# EAGLE schematic Mergen Ground Station_V2.0 (EAGLE 9.6.2)

## Sheet 1 of 5
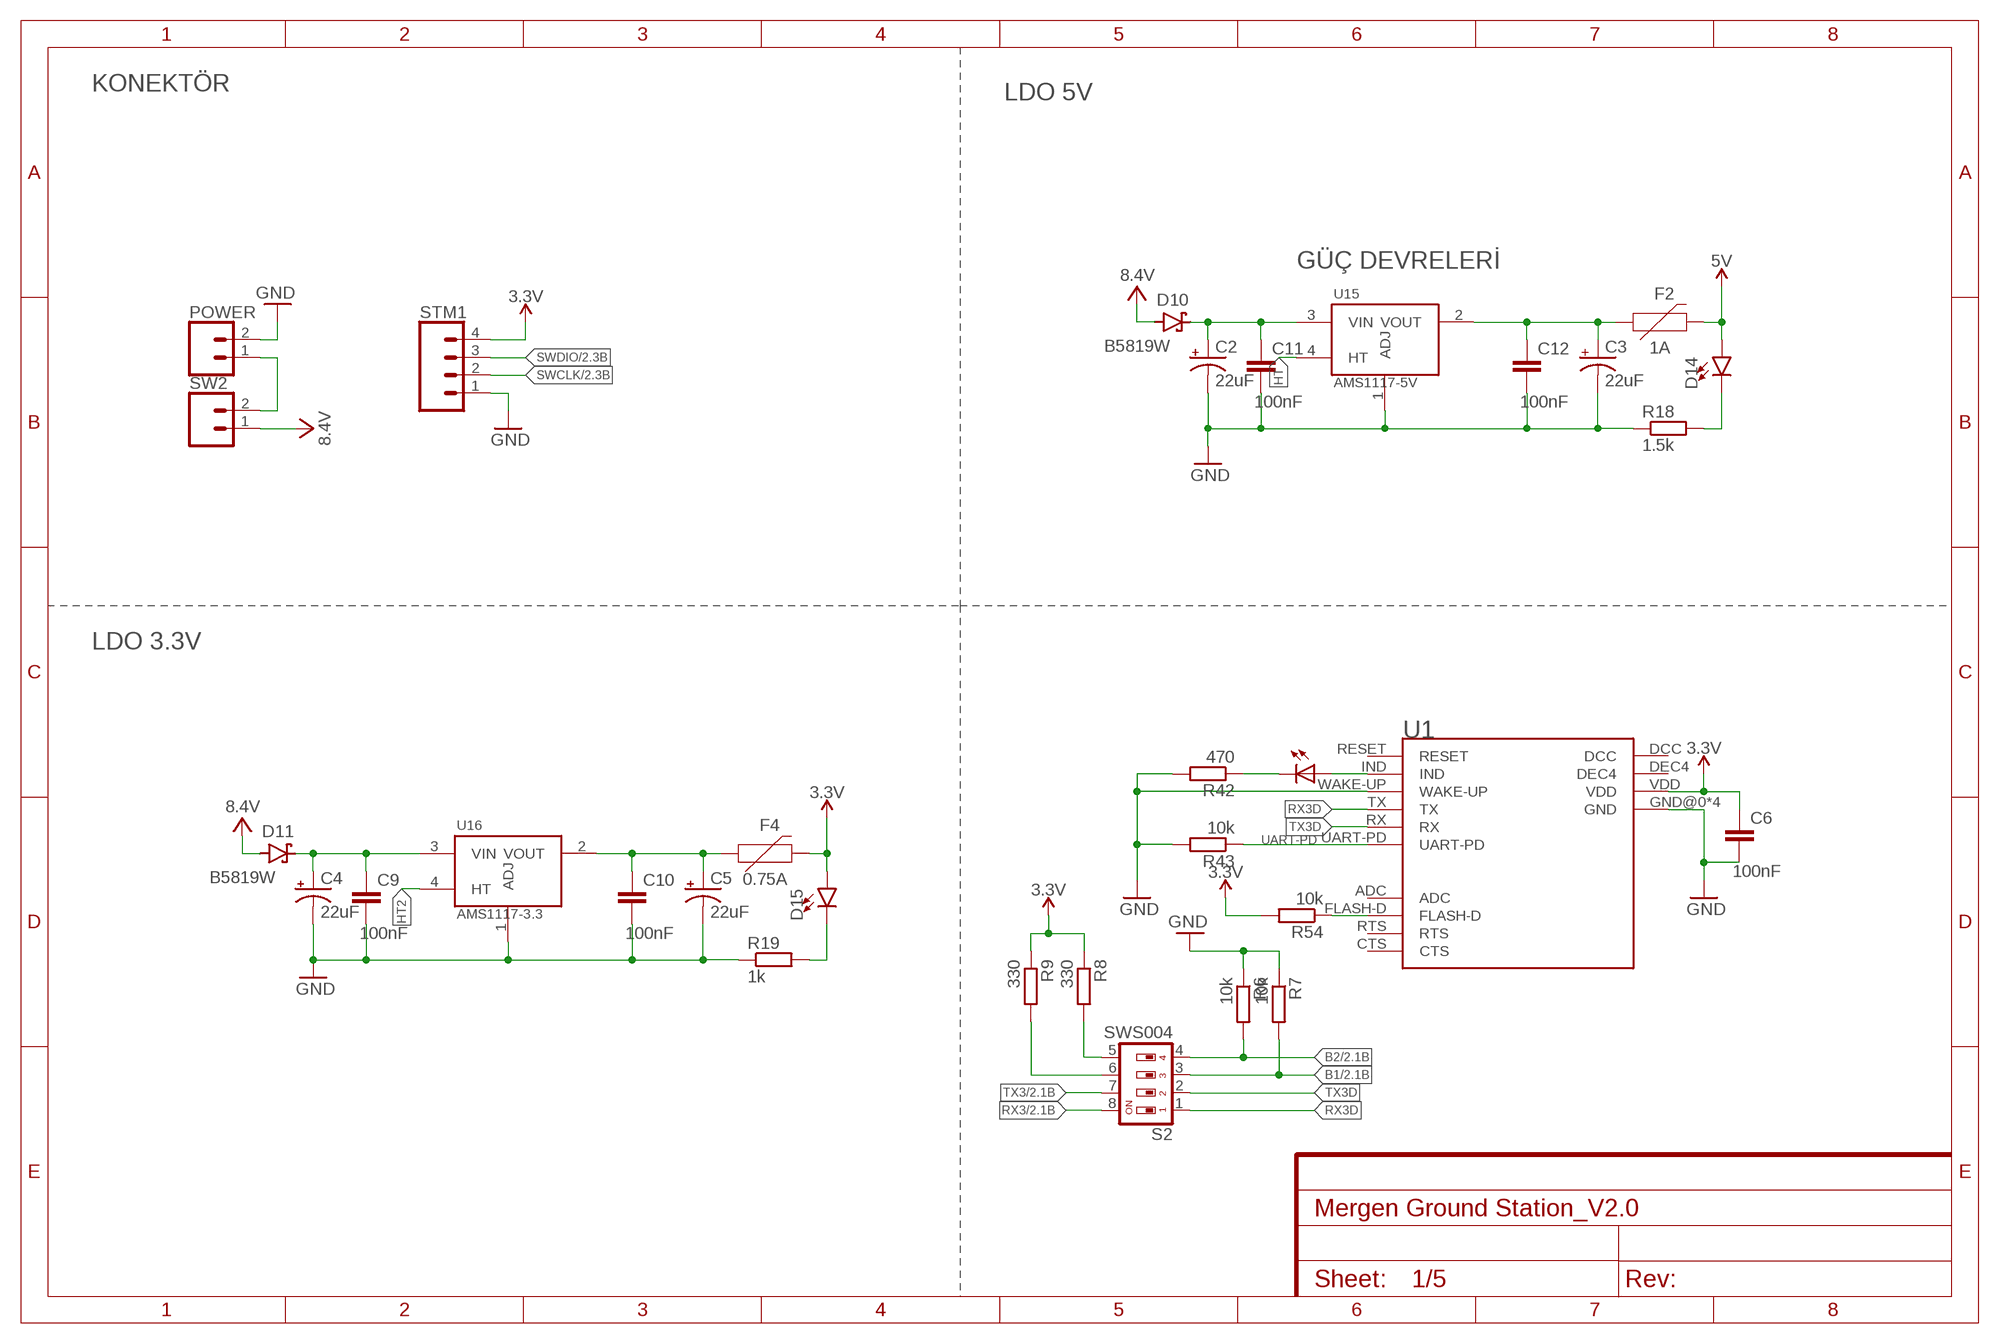
[diagram p0: schematic, sheet 1]

### Parts
C2  22uF  CPOL-USCT3528  [CT3528]
C3  22uF  CPOL-USCT3528  [CT3528]
C4  22uF  CPOL-USCT3528  [CT3528]
C5  22uF  CPOL-USCT3528  [CT3528]
C6  100nF  C-EUC0603  [C0603]
C9  100nF  C-EUC0603  [C0603]
C10  100nF  C-EUC0603  [C0603]
C11  100nF  C-EUC0603  [C0603]
C12  100nF  C-EUC0603  [C0603]
D10  B5819W  SCHOTTKY_MBR0520LT1GDO-219  [SODFL3718X115]
D11  B5819W  SCHOTTKY_MBR0520LT1GDO-219  [SODFL3718X115]
D14  LED0603  [LED-0603]
D15  LED0603  [LED-0603]
DRM3  kirmizi  LEDCHIP-LED0805  [CHIP-LED0805]
F2  1A  PPTC_HALF-AMP  [1206]
F4  0.75A  PPTC_HALF-AMP  [1206]
POWER  CONN_023.5MM-NO_SILK  [SCREWTERMINAL-3.5MM-2-NS]
R6  10k  R-EU_R0603  [R0603]
R7  10k  R-EU_R0603  [R0603]
R8  330  R-EU_R0603  [R0603]
R9  330  R-EU_R0603  [R0603]
R18  1.5k  R-EU_R0603  [R0603]
R19  1k  R-EU_R0603  [R0603]
R42  470  R-EU_R0603  [R0603]
R43  10k  R-EU_R0603  [R0603]
R54  10k  R-EU_R0603  [R0603]
S2  SWS004  [SMS-004]
STM1  CONN_04  [1X04]
SW2  CONN_023.5MM-NO_SILK  [SCREWTERMINAL-3.5MM-2-NS]
U1  MDBT42T-AT  [MDBT42T-AT]
U15  AMS1117-5V  AMS1117-3.3  [SOT229P700X180-4N]
U16  AMS1117-3.3  [SOT229P700X180-4N]

### Nets
3.3V: C6.1 D15.A F4.2 R8.1 R9.1 R54.2 STM1.4 U1.VDD ; also sheet 2,3,5
5V: D14.A F2.2 ; also sheet 4,5
B1: R7.2 S2.3 ; also sheet 2
B2: R6.2 S2.4 ; also sheet 2
FLASH-D: R54.1 U1.FLASH-D ; also sheet 2
GND: C2.- C3.- C4.- C5.- C6.2 C9.2 C10.2 C11.2 C12.2 POWER.2 R6.1 R7.1 R18.1 R19.1 R42.2 R43.2 STM1.1 U1.GND@0(GND) U1.GND@1(GND) U1.GND@2(GND) U1.GND@3(GND) U1.WAKE-UP U15.1(ADJ) U16.1(ADJ) ; also sheet 2,3,4,5
HT: U15.4(HT)
HT2: U16.4(HT)
N$5: DRM3.A U1.IND
N$6: DRM3.C R42.1
N$7: R9.2 S2.6
N$8: R8.2 S2.5
N$22: C2.+ C11.1 D10.1(C) U15.3(VIN)
N$23: C3.+ C12.1 F2.1 U15.2(VOUT)
N$24: C4.+ C9.1 D11.1(C) U16.3(VIN)
N$25: C5.+ C10.1 F4.1 U16.2(VOUT)
N$30: POWER.1 SW2.2
N$35: D14.C R18.2
N$36: D15.C R19.2
RX3: S2.8 ; also sheet 2,5
RX3D: S2.1 U1.TX
SWCLK: STM1.2 ; also sheet 2
SWDIO: STM1.3 ; also sheet 2
TX3: S2.7 ; also sheet 2,5
TX3D: S2.2 U1.RX
UART-PD: R43.1 U1.UART-PD ; also sheet 2
VCC: D10.2(A) D11.2(A) SW2.1 ; supply symbol labelled 8.4V ; also sheet 2,5
Unconnected: U1.ADC U1.CTS U1.DCC U1.DEC4 U1.RESET U1.RTS

### Notes on the sheet
- KONEKTÖR
- LDO 5V
- GÜÇ DEVRELERİ
- LDO 3.3V

## Sheet 2 of 5
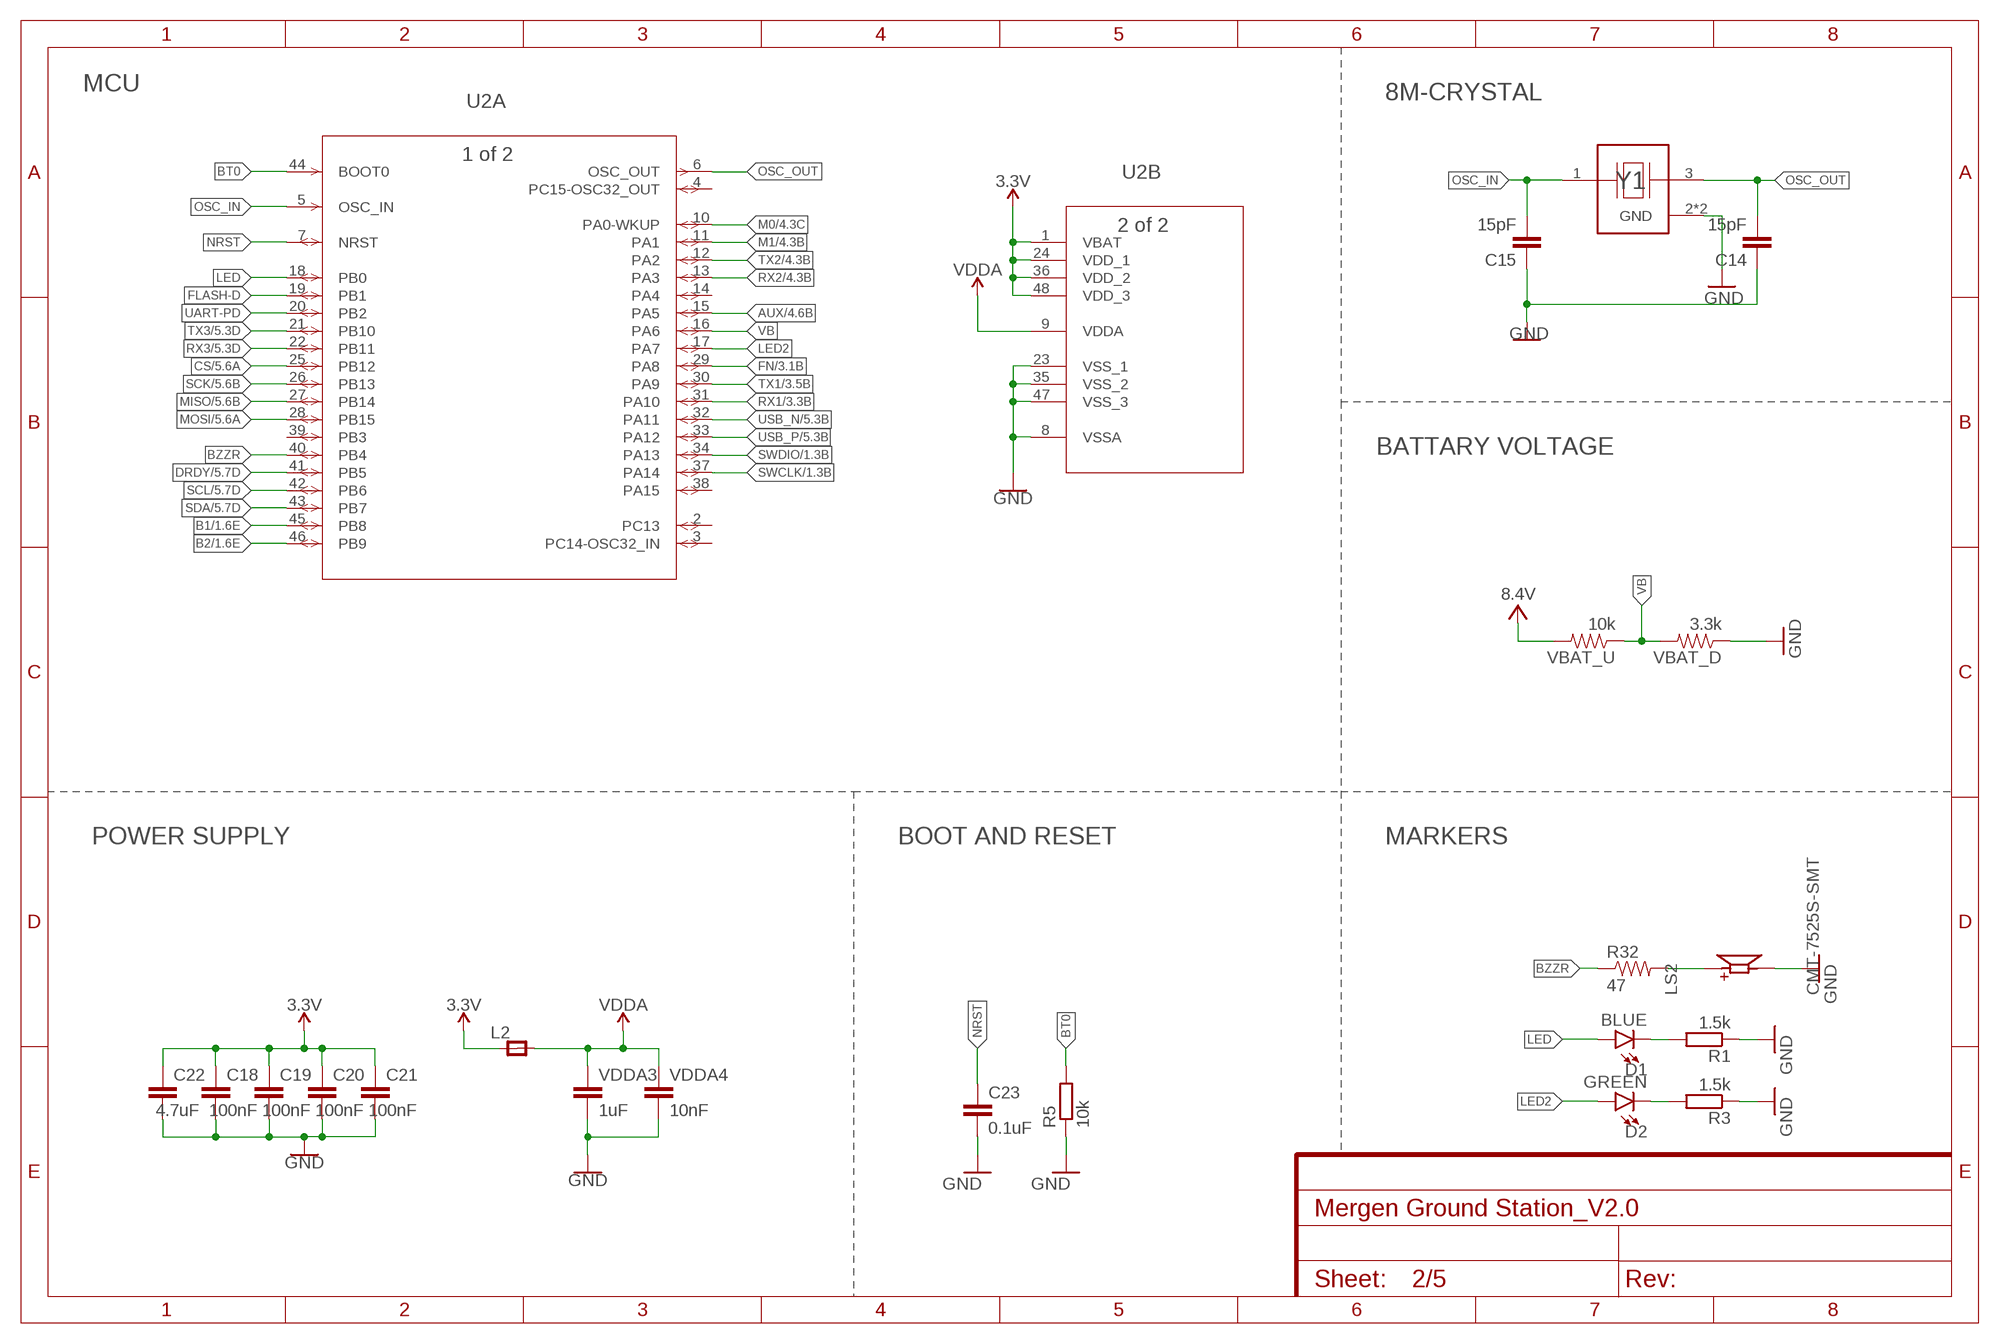
[diagram p1: schematic, sheet 2]

### Parts
C14  15pF  C-EUC0603  [C0603]
C15  15pF  C-EUC0603  [C0603]
C18  100nF  C-EUC0603  [C0603]
C19  100nF  C-EUC0603  [C0603]
C20  100nF  C-EUC0603  [C0603]
C21  100nF  C-EUC0603  [C0603]
C22  4.7uF  C-EUC0603  [C0603]
C23  0.1uF  C-EUC0603  [C0603]
D1  BLUE  LED0603  [LED-0603]
D2  GREEN  LED0603  [LED-0603]
L2  RC-MASTER-SMD_FB_0805MP  [RC-MASTER-SMD_L0805MP]
LS2  CMT-7525S-SMT  [CUI_CMT-7525S-SMT]
R1  1.5k  R-EU_R0603  [R0603]
R3  1.5k  R-EU_R0603  [R0603]
R5  10k  R-EU_R0603  [R0603]
R32  47  0OHM-0603-1/10W-5%  [0603]
U2  STM32F103C8T6  [LQFP48-7X7MM]
VBAT_D  3.3k  2.0KOHM1/10W5%(0603)  [0603-RES]
VBAT_U  10k  2.0KOHM1/10W5%(0603)  [0603-RES]
VDDA3  1uF  0.1UF-0603-25V-(+80/-20%)  [0603]
VDDA4  10nF  0.1UF-0603-25V-(+80/-20%)  [0603]
Y1  ABMM2-8.000MHZ-E2-T  [XTAL_ABMM2-8.000MHZ-E2-T]

### Nets
3.3V: C18.1 C19.1 C20.1 C21.1 C22.1 L2.1 U2.1(B:VBAT) U2.24(B:VDD_1) U2.36(B:VDD_2) U2.48(B:VDD_3) ; also sheet 1,3,5
AUX: U2.15(A:PA5) ; also sheet 4
B1: U2.45(A:PB8) ; also sheet 1
B2: U2.46(A:PB9) ; also sheet 1
BT0: R5.2 U2.44(A:BOOT0)
BZZR: R32.1 U2.40(A:PB4)
CS: U2.25(A:PB12) ; also sheet 5
DRDY: U2.41(A:PB5) ; also sheet 5
FLASH-D: U2.19(A:PB1) ; also sheet 1
FN: U2.29(A:PA8) ; also sheet 3
GND: C14.1 C15.1 C18.2 C19.2 C20.2 C21.2 C22.2 C23.2 LS2.N R1.1 R3.1 R5.1 U2.8(B:VSSA) U2.23(B:VSS_1) U2.35(B:VSS_2) U2.47(B:VSS_3) VBAT_D.1 VDDA3.2 VDDA4.2 Y1.2(GND) Y1.4(GND) ; also sheet 1,3,4,5
LED: D1.A U2.18(A:PB0)
LED2: D2.A U2.17(A:PA7)
M0: U2.10(A:PA0-WKUP) ; also sheet 4
M1: U2.11(A:PA1) ; also sheet 4
MISO: U2.27(A:PB14) ; also sheet 5
MOSI: U2.28(A:PB15) ; also sheet 5
N$1: D1.C R1.2
N$3: D2.C R3.2
N$4: LS2.P R32.2
NRST: C23.1 U2.7(A:NRST)
OSC_IN: C15.2 U2.5(A:OSC_IN) Y1.1
OSC_OUT: C14.2 U2.6(A:OSC_OUT) Y1.3
RX1: U2.31(A:PA10) ; also sheet 3
RX2: U2.13(A:PA3) ; also sheet 4
RX3: U2.22(A:PB11) ; also sheet 1,5
SCK: U2.26(A:PB13) ; also sheet 5
SCL: U2.42(A:PB6) ; also sheet 5
SDA: U2.43(A:PB7) ; also sheet 5
SWCLK: U2.37(A:PA14) ; also sheet 1
SWDIO: U2.34(A:PA13) ; also sheet 1
TX1: U2.30(A:PA9) ; also sheet 3
TX2: U2.12(A:PA2) ; also sheet 4
TX3: U2.21(A:PB10) ; also sheet 1,5
UART-PD: U2.20(A:PB2) ; also sheet 1
USB_N: U2.32(A:PA11) ; also sheet 5
USB_P: U2.33(A:PA12) ; also sheet 5
VB: U2.16(A:PA6) VBAT_D.2 VBAT_U.1
VCC: VBAT_U.2 ; supply symbol labelled 8.4V ; also sheet 1,5
VDDA: L2.2 U2.9(B:VDDA) VDDA3.1 VDDA4.1
Unconnected: U2.2(A:PC13) U2.3(A:PC14-OSC32_IN) U2.4(A:PC15-OSC32_OUT) U2.14(A:PA4) U2.38(A:PA15) U2.39(A:PB3)

### Notes on the sheet
- MCU
- 8M-CRYSTAL
- BATTARY VOLTAGE
- POWER SUPPLY | BOOT AND RESET | MARKERS

## Sheet 3 of 5
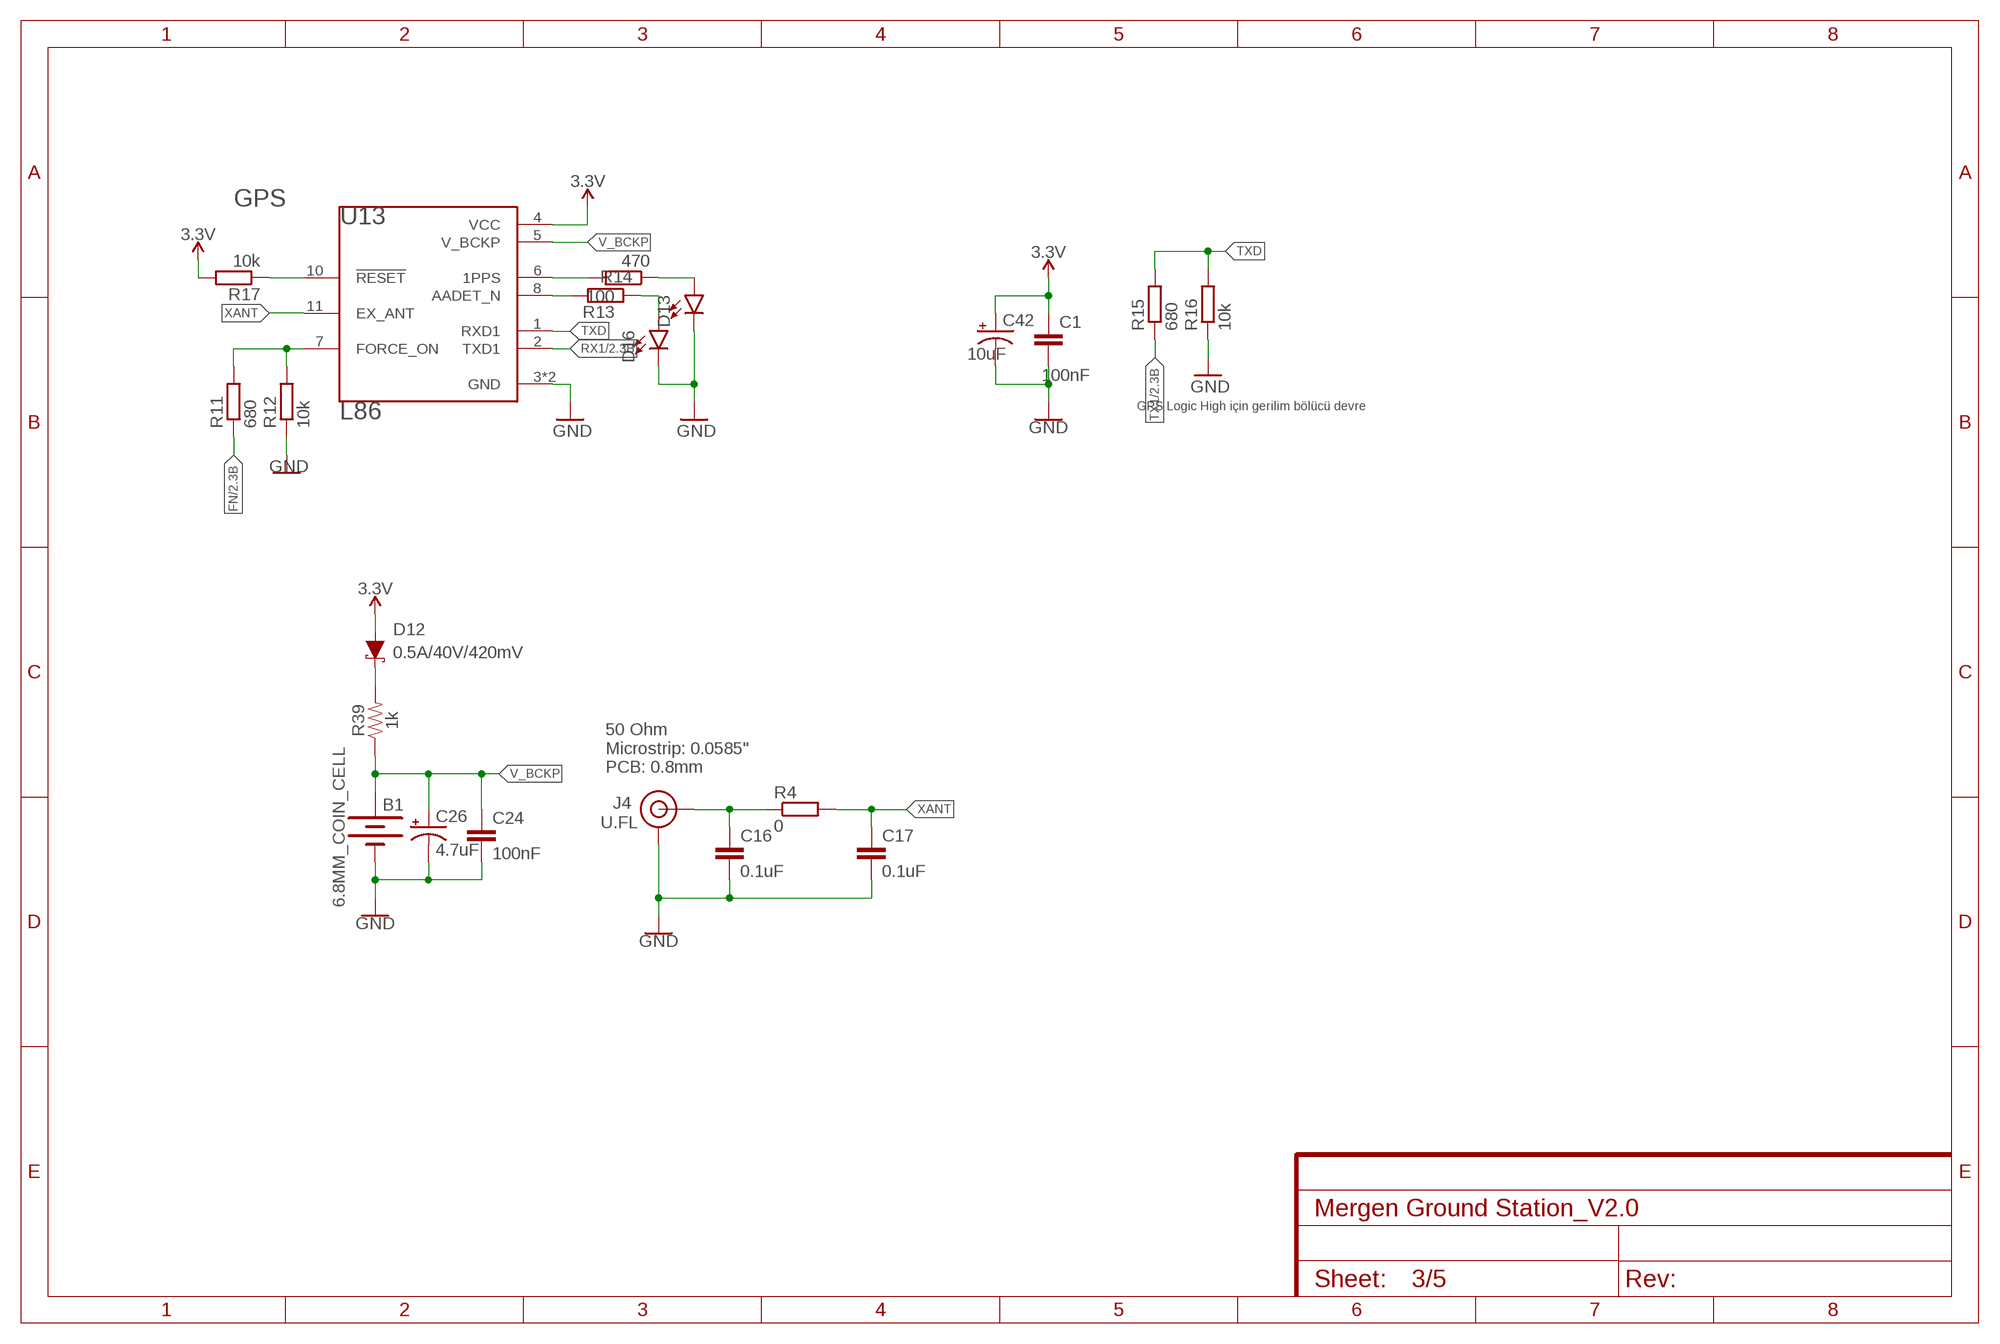
[diagram p2: schematic, sheet 3]

### Parts
B1  6.8MM_COIN_CELL  BATTERY-6.8MM_SMD  [BATTCON-6.8MM]
C1  100nF  C-EUC0603  [C0603]
C16  0.1uF  C-EUC0603  [C0603]
C17  0.1uF  C-EUC0603  [C0603]
C24  100nF  C-EUC0603  [C0603]
C26  4.7uF  CPOL-USA/3216-18R  [A/3216-18R]
C42  10uF  10UF-POLAR-EIA3216-16V-10%(TANT)  [EIA3216]
D12  0.5A/40V/420mV  DIODE-SCHOTTKY-PMEG4005EJ  [SOD-323]
D13  LED0603  [LED-0603]
D16  LED0603  [LED-0603]
J4  U.FL  U.FL2PIN  [U.FL]
R4  0  R-EU_R0603  [R0603]
R11  680  R-EU_R0603  [R0603]
R12  10k  R-EU_R0603  [R0603]
R13  100  R-EU_R0603  [R0603]
R14  470  R-EU_R0603  [R0603]
R15  680  R-EU_R0603  [R0603]
R16  10k  R-EU_R0603  [R0603]
R17  10k  R-EU_R0603  [R0603]
R39  1k  1KOHM-0603-1/10W-1%  [0603]
U13  L86  [XCVR_L86]

### Nets
3.3V: C1.1 C42.+ D12.A R17.2 U13.4(VCC) ; also sheet 1,2,5
FN: R11.1 ; also sheet 2
GND: B1.- C1.2 C16.2 C17.2 C24.2 C26.- C42.- D13.C D16.C J4.1(GND) J4.2(GND) R12.1 R16.1 U13.3(GND) U13.12(GND) ; also sheet 1,2,4,5
N$2: D16.A R13.1
N$31: D12.C R39.2
N$32: R17.1 U13.10(!RESET)
N$33: R14.2 U13.6(1PPS)
N$34: D13.A R14.1
N$37: R13.2 U13.8(AADET_N)
N$39: C16.1 J4.FEED(SIGNAL) R4.1
N$40: R11.2 R12.2 U13.7(FORCE_ON)
RX1: U13.2(TXD1) ; also sheet 2
TX1: R15.1 ; also sheet 2
TXD: R15.2 R16.2 U13.1(RXD1)
V_BCKP: B1.+ C24.1 C26.+ R39.1 U13.5(V_BCKP)
XANT: C17.1 R4.2 U13.11(EX_ANT)

### Notes on the sheet
- GPS
- GPS Logic High için gerilim bölücü devre
- 50 Ohm 
  Microstrip: 0.0585"
  PCB: 0.8mm

## Sheet 4 of 5
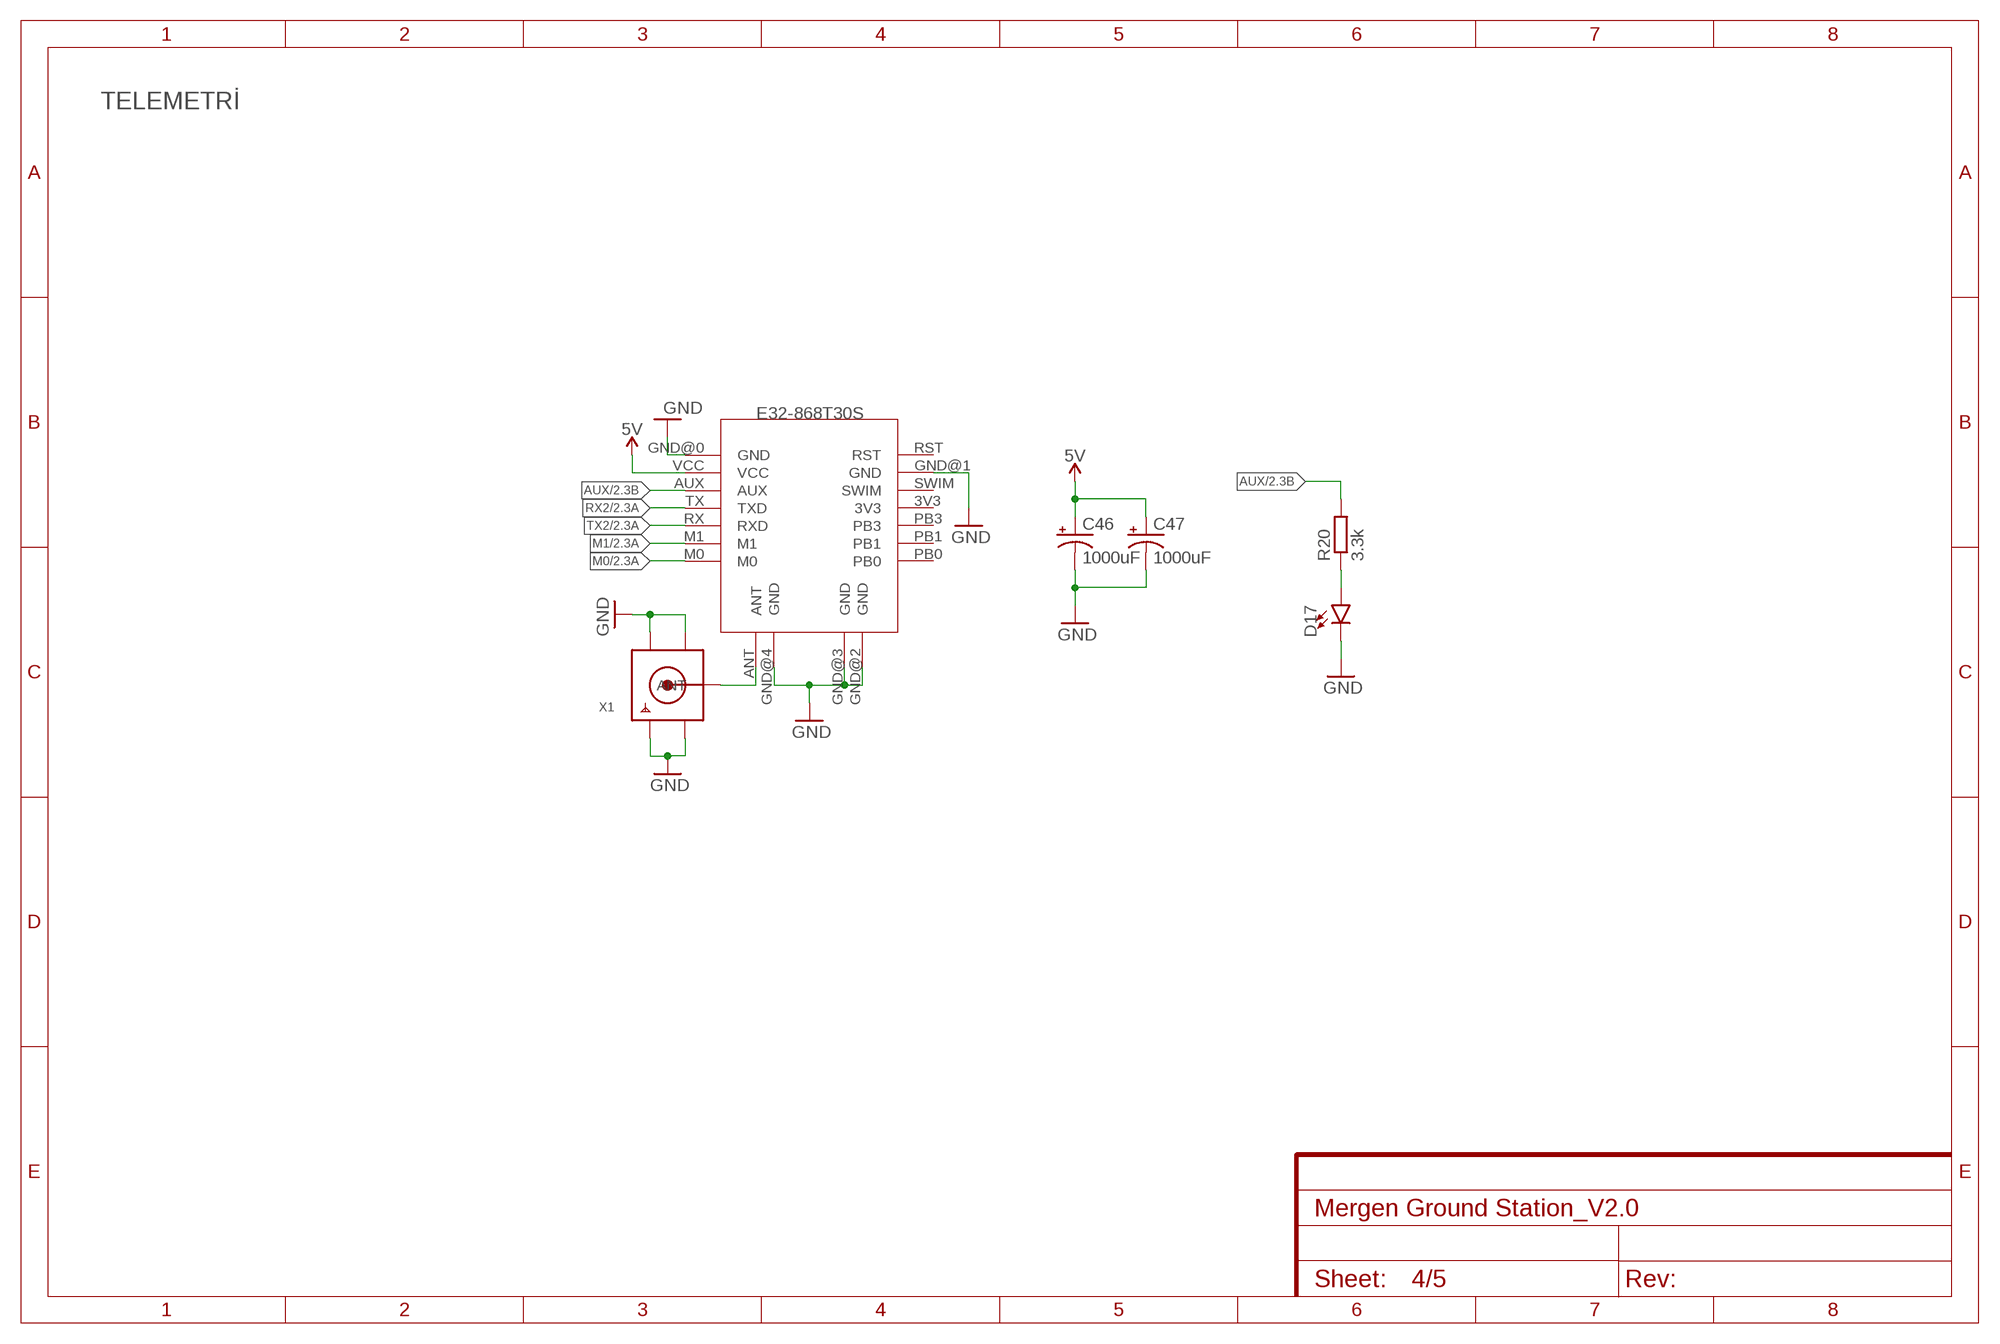
[diagram p3: schematic, sheet 4]

### Parts
C46  1000uF  CPOL-US150CLZ-1010  [150CLZ-1010]
C47  1000uF  CPOL-US150CLZ-1010  [150CLZ-1010]
D17  LED0603  [LED-0603]
R20  3.3k  R-EU_R0603  [R0603]
U14  E32-868T30S  [E32-868T30S]
X1  SMACONNECTOR  [SMA90_DIP]

### Nets
5V: C46.+ C47.+ U14.VCC ; also sheet 1,5
AUX: R20.2 U14.AUX ; also sheet 2
GND: C46.- C47.- D17.C U14.GND@0(GND) U14.GND@1(GND) U14.GND@2(GND) U14.GND@3(GND) U14.GND@4(GND) X1.GND1 X1.GND2 X1.GND3 X1.GND4 ; also sheet 1,2,3,5
M0: U14.M0 ; also sheet 2
M1: U14.M1 ; also sheet 2
N$27: U14.ANT X1.ANTENNA(ANT)
N$41: D17.A R20.1
RX2: U14.TX(TXD) ; also sheet 2
TX2: U14.RX(RXD) ; also sheet 2
Unconnected: U14.3V3 U14.PB0 U14.PB1 U14.PB3 U14.RST U14.SWIM

### Notes on the sheet
- TELEMETRİ

## Sheet 5 of 5
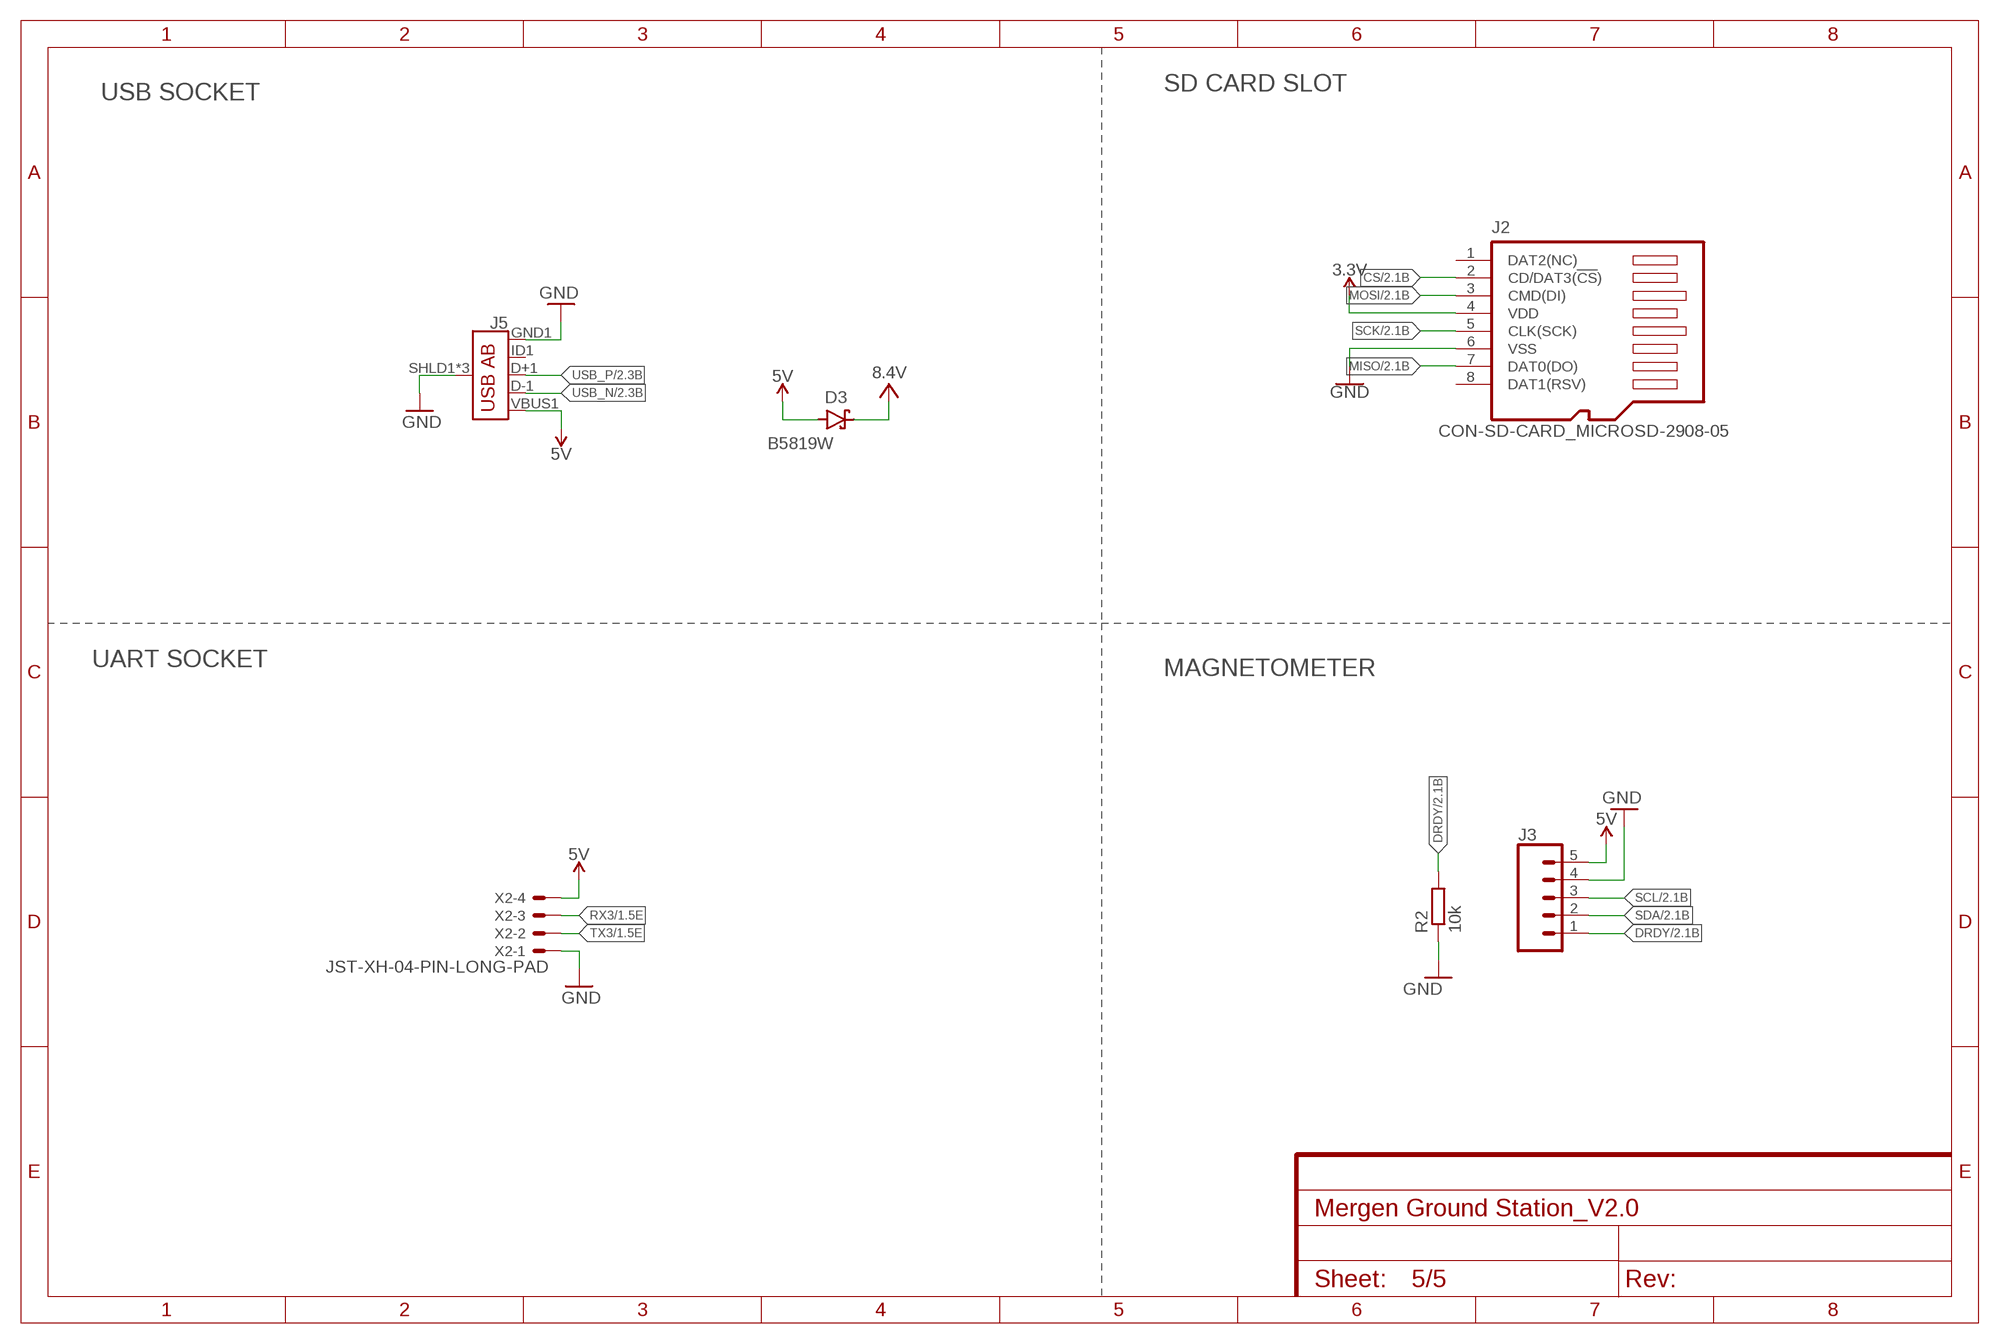
[diagram p4: schematic, sheet 5]

### Parts
D3  B5819W  SCHOTTKY_MBR0520LT1GDO-219  [SODFL3718X115]
J2  CON-SD-CARD_MICROSD-2908-05  [CON-SD-CARD_2908-05]
J3  CONN_05LOCK_LONGPADS  [1X05_LOCK_LONGPADS]
J5  USB_AB_SMT  [USB-AB-MICRO-SMD]
R2  10k  R-EU_R0603  [R0603]
X2  JST-XH-04-PIN-LONG-PAD  [JST-XH-04-PACKAGE-LONG-PAD]

### Nets
3.3V: J2.4(VDD) ; also sheet 1,2,3
5V: D3.2(A) J3.5 J5.VBUS1(VBUS) X2.4 ; also sheet 1,4
CS: J2.2(CD/DAT3(!CS!)) ; also sheet 2
DRDY: J3.1 R2.2 ; also sheet 2
GND: J2.6(VSS) J3.4 J5.GND1(GND) J5.SHLD1(SHIELD) J5.SHLD2(SHIELD) J5.SHLD3(SHIELD) R2.1 X2.1 ; also sheet 1,2,3,4
MISO: J2.7(DAT0(DO)) ; also sheet 2
MOSI: J2.3(CMD(DI)) ; also sheet 2
RX3: X2.3 ; also sheet 1,2
SCK: J2.5(CLK(SCK)) ; also sheet 2
SCL: J3.3 ; also sheet 2
SDA: J3.2 ; also sheet 2
TX3: X2.2 ; also sheet 1,2
USB_N: J5.D-1(D-) ; also sheet 2
USB_P: J5.D+1(D+) ; also sheet 2
VCC: D3.1(C) ; supply symbol labelled 8.4V ; also sheet 1,2
Unconnected: J2.1(DAT2(NC)) J2.8(DAT1(RSV)) J2.GND@1(GND) J2.GND@2(GND) J2.GND@3(GND) J2.GND@4(GND) J5.ID1(USBID)

### Notes on the sheet
- SD CARD SLOT
- USB SOCKET
- UART SOCKET
- MAGNETOMETER

## Library data of the parts
B1 = SparkFun-Batteries:BATTERY: Battery - Single Cell A variety of battery chemistries, sizes, and footprints. Device List: 20MM_PTH - Coin Cell Battery Holder - 20mm (PTH) <https://www.sparkfun.com/products/783> 6.8MM_PTH - Coin Cell Battery Holder - 6.8MM(SMD) <https://www.digikey.com/product-detail/en/seiko-instruments/MS621FE-FL11E/728-1057-ND/1889208?WT.srch=1&gclid=CNOQ5a6LzdQCFZS2wAodXCkE0g> 12MM_SMD - Coin Cell Battery Holder - 12mm (SMD) <https://www.sparkfun.com/products/10592> 12MM_PTH - Coin Cell Battery Holder - 12mm (PTH) <https://www.sparkfun.com/products/7948> 20MM_SMD - 20mm Coin Cell Battery Holder (SMD) (2 legs) Used on the Big Time Watch Kit <https://www.sparkfun.com/products/11734> 20MM_SMD_4LEGS - Coin Cell Battery Holder - 20mm (SMD) <https://www.sparkfun.com/products/11892> 20MM_SMD_4LEGS_OVERPASTE - Coin Cell Battery Holder - 20mm (SMD) <https://www.sparkfun.com/products/11892> (Over-paste on the legs) 24.5MM_PTH - Coin Cell Battery Holder - 24.5mm (PTH) <https://www.sparkfun.com/products/8863> 9V - 9V Battery Holder - PC Mount Used on the SparkFun SparkPunk Sound Kit <https://www.sparkfun.com/products/11177> and SparkFun SparkPunk Sequencer Kit <https://www.sparkfun.com/products/12707> 18650 - Battery Holder - 18650 (PTH) <https://www.sparkfun.com/products/13113> AA - Battery Holder - 1xAA (PTH) <https://www.sparkfun.com/products/7949> AAA - Battery Holder - 1xAAA (PTH) <https://www.sparkfun.com/products/12718> AA_KIT - Battery Holder - 1xAA (PTH) <https://www.sparkfun.com/products/7949> Special kit package - pads only have exposed copper on one side of the board. AAA_KIT - Battery Holder - 1xAAA (PTH) <https://www.sparkfun.com/products/12718> Special kit package - pads only have exposed copper on one side of the board.; PROD_ID: BATT-13734
C1 C6 C9-C12 C14-C24 = rcl:C-EU: CAPACITOR, European symbol; SPICEPREFIX: C
C2-C5 C26 = rcl:CPOL-US: POLARIZED CAPACITOR, American symbol; SPICEPREFIX: C
C42 = SparkFun-Capacitors:10UF-POLAR: 10.0µF polarized capacitors A capacitor is a passive two-terminal electrical component used to store electrical energy temporarily in an electric field.; PROD_ID: CAP-00811
C46 C47 = adafruit:CPOL-US: POLARIZED CAPACITOR, American symbol
D1 D2 D13-D17 = SparkFun-LED:LED: LED (Generic) Standard schematic elements and footprints for 5mm, 3mm, 1206, and 0603 sized LEDs. Generic LEDs with no color specified.
D3 D10 D11 = Diode:SCHOTTKY_: Schottky Diode - Popular parts; CATEGORY: Diode; DESCRIPTION: DIODE SCHOTTKY 20V 500MA SOD123; MANUFACTURER: ON Semiconductor; MPN: MBR0520LT1G; SUB-CATEGORY: Schottky; VALUE: MBR0520LT1G
D12 = SparkFun-DiscreteSemi:DIODE-SCHOTTKY: Schottky diode A Schottky diode is a semiconductor diode which has a low forward voltage drop and a very fast switching action.; PROD_ID: DIO-10955
DRM3 = led:LED: LED OSRAM: - CHIPLED LG R971, LG N971, LY N971, LG Q971, LY Q971, LO R971, LY R971 LH N974, LH R974 LS Q976, LO Q976, LY Q976 LO Q996 - Hyper CHIPLED LW Q18S LB Q993, LB Q99A, LB R99A - SideLED LS A670, LO A670, LY A670, LG A670, LP A670 LB A673, LV A673, LT A673, LW A673 LH A674 LY A675 LS A676, LA A676, LO A676, LY A676, LW A676 LS A679, LY A679, LG A679 - Hyper Micro SIDELED® LS Y876, LA Y876, LO Y876, LY Y876 LT Y87S - SmartLED LW L88C, LW L88S LB L89C, LB L89S, LG L890 LS L89K, LO L89K, LY L89K LS L896, LA L896, LO L896, LY L896 - TOPLED LS T670, LO T670, LY T670, LG T670, LP T670 LSG T670, LSP T670, LSY T670, LOP T670, LYG T670 LG T671, LOG T671, LSG T671 LB T673, LV T673, LT T673, LW T673 LH T674 LS T676, LA T676, LO T676, LY T676, LB T676, LH T676, LSB T676, LW T676 LB T67C, LV T67C, LT T67C, LS T67K, LO T67K, LY T67K, LW E67C LS E67B, LA E67B, LO E67B, LY E67B, LB E67C, LV E67C, LT E67C LW T67C LS T679, LY T679, LG T679 LS T770, LO T770, LY T770, LG T770, LP T770 LB T773, LV T773, LT T773, LW T773 LH T774 LS E675, LA E675, LY E675, LS T675 LS T776, LA T776, LO T776, LY T776, LB T776 LHGB T686 LT T68C, LB T68C - Hyper Mini TOPLED® LB M676 - Mini TOPLED Santana® LG M470 LS M47K, LO M47K, LY M47K Source: http://www.osram.convergy.de LUXEON: - LUMILED® LXK2-PW12-R00, LXK2-PW12-S00, LXK2-PW14-U00, LXK2-PW14-V00 LXK2-PM12-R00, LXK2-PM12-S00, LXK2-PM14-U00 LXK2-PE12-Q00, LXK2-PE12-R00, LXK2-PE12-S00, LXK2-PE14-T00, LXK2-PE14-U00 LXK2-PB12-K00, LXK2-PB12-L00, LXK2-PB12-M00, LXK2-PB14-N00, LXK2-PB14-P00, LXK2-PB14-Q00 LXK2-PR12-L00, LXK2-PR12-M00, LXK2-PR14-Q00, LXK2-PR14-R00 LXK2-PD12-Q00, LXK2-PD12-R00, LXK2-PD12-S00 LXK2-PH12-R00, LXK2-PH12-S00 LXK2-PL12-P00, LXK2-PL12-Q00, LXK2-PL12-R00 Source: www.luxeon.com KINGBRIGHT: KA-3528ASYC Source: www.kingbright.com
F2 F4 = SparkFun-Fuses:PPTC: Resettable Fuse PPTC Resettable Fuse. Really a sort of resistor with a polymeric positive temperature coefficient whose resistance increases dramatically with an increase in temperature. When heated by the power passing through the resistance rises causing the current to be limited, protecting the circuit. This is achieved by the transition of the polymer from a crystalline to an amorphous state where the conductive carbon separates breaking the conductive pathways found in the cool crystalline structure. When a PPTC cools back down it resumes conducting letting the circuit turn back on. SparkFun Products: SparkFun RedBoard - Programmed with Arduino <https://www.sparkfun.com/products/12757> Pro Micro - 5V/16MHz <https://www.sparkfun.com/products/12640> Arduino Pro 328 - 5V/16MHz <https://www.sparkfun.com/products/10915> MP3 Trigger <https://www.sparkfun.com/products/13720>; PROD_ID: RES-08585; VALUE: 6V/0.5A
J2 = 52101-101-REV-A_v16:CON-SD-CARD_MICROSD-: microSD Connector
J3 = SparkFun-Connectors:CONN_05: Multi connection point. Often used as Generic Header-pin footprint for 0.1 inch spaced/style header connections On any of the 0.1 inch spaced packages, you can populate with these: Break Away Headers - Straight <https://www.sparkfun.com/products/116> (PRT-00116) Break Away Male Headers - Right Angle <https://www.sparkfun.com/products/553> (PRT-00553) Female Headers <https://www.sparkfun.com/products/115> (PRT-00115) Break Away Headers - Machine Pin <https://www.sparkfun.com/products/117> (PRT-00117) Break Away Female Headers - Swiss Machine Pin <https://www.sparkfun.com/products/743> (PRT-00743) For SCREWTERMINALS and SPRING TERMINALS visit here: Screw Terimnals on SparkFun.com <https://www.sparkfun.com/search/results?term=Screw+Terminals> (5mm/3.5mm/2.54mm spacing) This device is also useful as a general connection point to wire up your design to another part of your project. Our various solder wires solder well into these plated through hole pads. Hook-Up Wire - Assortment (Stranded, 22 AWG) <https://www.sparkfun.com/products/11375> (PRT-11375) Hook-Up Wire - Assortment (Solid Core, 22 AWG) <https://www.sparkfun.com/products/11367> (PRT-11367) View the entire wire category on our website here <https://www.sparkfun.com/categories/141> Special notes: Molex polarized connector foot print use with SKU : PRT-08231 with associated crimp pins and housings. 1MM SMD Version SKU: PRT-10208
J4 = SparkFun-Connectors:U.FL2PIN: SMD Antenna Connector - U.FL 2mm height, 3.0mm x 3.0mm receptacle size. SparkFun Products: SparkFun WiFi Shield - ESP8266 <https://www.sparkfun.com/products/13287> SparkFun ESP8266 Thing <https://www.sparkfun.com/products/13231> SparkFun MiniGen - Pro Mini Signal Generator Shield <https://www.sparkfun.com/products/11420>; PROD_ID: CONN-09193; SF_ID: WRL-09144
J5 = SparkFun-Connectors:USB_AB: USB Type AB Micro Connector OTG-compatible. 5 pins, 3 shield pins SparkFun Products: IOIO-OTG <https://www.sparkfun.com/products/13613> SparkFun SAMD21 Mini Breakout <https://www.sparkfun.com/products/13664>; PROD_ID: CONN-11794
L2 = 52101-101-REV-A_v16:RC-MASTER-SMD_FB_: FERRITE BEAD
LS2 = CMT-7525S-SMT:CMT-7525S-SMT: 7.5 mm, 3.6 Vo-p, 90 dB, Surface Mount (SMT), Magnetic Audio Transducer Buzzer Check prices <https://pricing.snapeda.com/parts/CMT-7525S-SMT-TR/CUI%20Devices/view-part?ref=eda>; AVAILABILITY: In Stock; CUI_PURCHASE_URL: https://www.cuidevices.com/product/audio/buzzers/audio-transducers/cmt-7525s-smt-tr?utm_source=snapeda.com&utm_medium=referral&utm_campaign=snapedaBOM; DESCRIPTION: 7.5 mm, 3.6 Vo-p, 90 dB, Surface Mount (SMT), Magnetic Audio Transducer Buzzer; MF: CUI Devices; MP: CMT-7525S-SMT-TR; PACKAGE: CUI Inc.; PRICE: None
POWER SW2 = SparkFun-Connectors:CONN_02: Multi connection point. Often used as Generic Header-pin footprint for 0.1 inch spaced/style header connections On any of the 0.1 inch spaced packages, you can populate with these: Break Away Headers - Straight <https://www.sparkfun.com/products/116> (PRT-00116) Break Away Male Headers - Right Angle <https://www.sparkfun.com/products/553> (PRT-00553) Female Headers <https://www.sparkfun.com/products/115> (PRT-00115) Break Away Headers - Machine Pin <https://www.sparkfun.com/products/117> (PRT-00117) Break Away Female Headers - Swiss Machine Pin <https://www.sparkfun.com/products/743> (PRT-00743) For SCREWTERMINALS and SPRING TERMINALS visit here: Screw Terimnals on SparkFun.com <https://www.sparkfun.com/search/results?term=Screw+Terminals> (5mm/3.5mm/2.54mm spacing) This device is also useful as a general connection point to wire up your design to another part of your project. Our various solder wires solder well into these plated through hole pads. Hook-Up Wire - Assortment (Stranded, 22 AWG) <https://www.sparkfun.com/products/11375> (PRT-11375) Hook-Up Wire - Assortment (Solid Core, 22 AWG) <https://www.sparkfun.com/products/11367> (PRT-11367) View the entire wire category on our website here <https://www.sparkfun.com/categories/141> Special notes: Molex polarized connector foot print use with: PRT-08233 with associated crimp pins and housings. 2.54_SCREWTERM for use with PRT-10571. 3.5mm Screw Terminal footprints for PRT-08084 5mm Screw Terminal footprints for use with PRT-08432; PROD_ID: CONN-08399
R1-R5 R11-R20 = rcl:R-EU_: RESISTOR, European symbol; SPICEPREFIX: R
R6-R9 R42 R43 R54 = rcl:R-EU_: RESISTOR, European symbol
R32 = SparkFun-Resistors:0OHM: 0Ω resistor A resistor is a passive two-terminal electrical component that implements electrical resistance as a circuit element. Resistors act to reduce current flow, and, at the same time, act to lower voltage levels within circuits. - Wikipedia; PROD_ID: RES-08609; VALUE: 0
R39 = SparkFun-Resistors:1KOHM: 1kΩ resistor A resistor is a passive two-terminal electrical component that implements electrical resistance as a circuit element. Resistors act to reduce current flow, and, at the same time, act to lower voltage levels within circuits. - Wikipedia; PROD_ID: RES-07856
S2 = smd-special:SWS004: SMD Dip Switch 4 pol.
STM1 = SparkFun-Connectors:CONN_04: Multi connection point. Often used as Generic Header-pin footprint for 0.1 inch spaced/style header connections On any of the 0.1 inch spaced packages, you can populate with these: Break Away Headers - Straight <https://www.sparkfun.com/products/116> (PRT-00116) Break Away Male Headers - Right Angle <https://www.sparkfun.com/products/553> (PRT-00553) Female Headers <https://www.sparkfun.com/products/115> (PRT-00115) Break Away Headers - Machine Pin <https://www.sparkfun.com/products/117> (PRT-00117) Break Away Female Headers - Swiss Machine Pin <https://www.sparkfun.com/products/743> (PRT-00743) For SCREWTERMINALS and SPRING TERMINALS visit here: Screw Terimnals on SparkFun.com <https://www.sparkfun.com/search/results?term=Screw+Terminals> (5mm/3.5mm/2.54mm spacing) This device is also useful as a general connection point to wire up your design to another part of your project. Our various solder wires solder well into these plated through hole pads. Hook-Up Wire - Assortment (Stranded, 22 AWG) <https://www.sparkfun.com/products/11375> (PRT-11375) Hook-Up Wire - Assortment (Solid Core, 22 AWG) <https://www.sparkfun.com/products/11367> (PRT-11367) View the entire wire category on our website here <https://www.sparkfun.com/categories/141> Special notes: Molex polarized connector foot print use with SKU : PRT-08231 with associated crimp pins and housings. 1MM SMD Version SKU: PRT-10208; PROD_ID: CONN-09696
U1 = ELTASSAN:MDBT42T-AT: MODULE BLUETOOTH BT4.2/5 nRF52805 SOC CHIP ANTENNA; COMPONENT: MODULE BLUETOOTH BT4.2/5 nRF52805 SOC CHIP ANTENNA; OZDISAN_NO: MDBT42T-AT
U2 = STM32F103C8T6:STM32F103C8T6; BUILT_BY: EMA_UL_Team; COPYRIGHT: Copyright (C) 2018 Accelerated Designs. All rights reserved; MANUFACTURER_PART_NUMBER: STM32F103C8T6; SOURCELIBRARY: Updates_to_database_2020-10-19; VENDOR: STMicroelectronics
U13 = L86:L86: L86 is an ultra-compact GNSS POT (Patch on Top) module with an embedded 18.4mm × 18.4mm × 4.0mm patch antenna and utilizes the MediaTek new generation GNSS chipset MT3333 that achieves the perfect performance; AVAILABILITY: Unavailable; DESCRIPTION: L86 is an ultra-compact GNSS POT (Patch on Top) module with an embedded 18.4mm × 18.4mm × 4.0mm patch antenna and utilizes the MediaTek new generation GNSS chipset MT3333 that achieves the perfect performance; MF: Quectel; MP: L86; PACKAGE: PowerSFN-8 Quectel; PRICE: None
U14 = E32-868T30S:E32-868T30S: E BYTE E32-868T30S
U15 U16 = AMS1117-3.3:AMS1117-3.3: Sot223/Pkg 1-Amp 3.3-Volt Low Drop Out Voltage Regulatator; AVAILABILITY: Unavailable; DESCRIPTION: Sot223/Pkg 1-Amp 3.3-Volt Low Drop Out Voltage Regulatator; MF: Advanced Monolithic Systems; MP: AMS1117-3.3; PACKAGE: SOT-89 ams; PRICE: None
VBAT_D VBAT_U = SparkFun-Resistors:2.0KOHM1/10W5%(0603): RES-08296; PROD_ID: RES-08296; VALUE: 2.0k
VDDA3 VDDA4 = SparkFun-Capacitors:0.1UF: 0.1µF ceramic capacitors A capacitor is a passive two-terminal electrical component used to store electrical energy temporarily in an electric field.; PROD_ID: CAP-00810; VALUE: 0.1uF
X1 = adafruit:SMACONNECTOR: SMA Connector 90° DIP SMA Connector, 50 Ohm (4UConnector: 07259)
X2 = Rembrandt Electronics - JST XH Connectors v1-0:JST-XH-04-PIN: JST XH Connector 2 Pin Wire to board connector. Pitch: 2,54 mm, (0.100") Number of pins: 4 Created by Rembrandt Electronics www.rembrandtelectronics.com
Y1 = ABMM2-8.000MHZ-E2-T (1):ABMM2-8.000MHZ-E2-T: Check prices <https://pricing.snapeda.com/parts/ABMM2-8.000MHZ-E2-T/Abracon/view-part?ref=eda>; AVAILABILITY: Good; DESCRIPTION: 8MHz ±20ppm Crystal 18pF 72 Ohms 4-SMD, No Lead; MF: Abracon; MP: ABMM2-8.000MHZ-E2-T; PACKAGE: SMD-4 Abracon; PRICE: None; PURCHASE-URL: https://pricing.snapeda.com/search/part/ABMM2-8.000MHZ-E2-T/?ref=eda